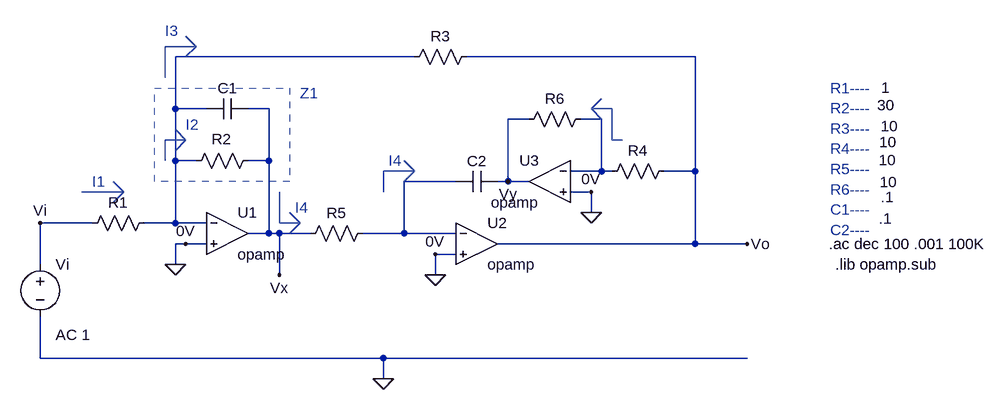
[diagram p0: schematic Simulacion TS2.asc]
Simulacion TS2.asc, the LTspice schematic file:
Version 4
SHEET 1 1208 680
WIRE 304 16 -64 16
WIRE 736 16 384 16
WIRE -64 96 -64 16
WIRE -16 96 -64 96
WIRE 80 96 48 96
WIRE 480 112 448 112
WIRE 592 112 560 112
WIRE -64 176 -64 96
WIRE -32 176 -64 176
WIRE 80 176 80 96
WIRE 80 176 48 176
WIRE 592 192 592 112
WIRE 592 192 544 192
WIRE 608 192 592 192
WIRE 736 192 736 16
WIRE 736 192 688 192
WIRE 368 208 288 208
WIRE 448 208 448 112
WIRE 448 208 432 208
WIRE 480 208 448 208
WIRE 576 224 544 224
WIRE 576 256 576 224
WIRE -192 272 -272 272
WIRE -64 272 -64 176
WIRE -64 272 -112 272
WIRE -16 272 -64 272
WIRE 80 288 80 176
WIRE 80 288 48 288
WIRE 96 288 80 288
WIRE 144 288 96 288
WIRE 288 288 288 208
WIRE 288 288 224 288
WIRE 368 288 288 288
WIRE -48 304 -64 304
WIRE -16 304 -48 304
WIRE 736 304 736 192
WIRE 736 304 432 304
WIRE 816 304 736 304
WIRE 368 320 336 320
WIRE -272 336 -272 272
WIRE -64 336 -64 304
WIRE 96 352 96 288
WIRE 336 352 336 320
WIRE -272 480 -272 416
WIRE 256 480 -272 480
WIRE 816 480 256 480
WIRE 256 512 256 480
FLAG 576 256 0
FLAG 336 352 0
FLAG -64 336 0
FLAG 256 512 0
FLAG 816 304 Vo
FLAG -272 272 Vi
FLAG 336 320 0V
FLAG -48 304 0V
FLAG 576 224 0V
FLAG 96 352 Vx
FLAG 448 208 Vy
SYMBOL res -96 256 R90
WINDOW 0 0 56 VBottom 2
WINDOW 3 -208 -1125 VTop 2
SYMATTR InstName R1
SYMATTR Value 1
SYMBOL res 64 160 R90
WINDOW 0 -2 57 VBottom 2
WINDOW 3 -85 -966 VTop 2
SYMATTR InstName R2
SYMATTR Value 30
SYMBOL res 400 0 R90
WINDOW 0 0 56 VBottom 2
WINDOW 3 107 -635 VTop 2
SYMATTR InstName R3
SYMATTR Value 10
SYMBOL res 576 96 R90
WINDOW 0 0 56 VBottom 2
WINDOW 3 97 -458 VTop 2
SYMATTR InstName R6
SYMATTR Value 10
SYMBOL res 240 272 R90
WINDOW 0 0 56 VBottom 2
WINDOW 3 -113 -792 VTop 2
SYMATTR InstName R5
SYMATTR Value 10
SYMBOL res 704 176 R90
WINDOW 0 0 56 VBottom 2
WINDOW 3 -44 -329 VTop 2
SYMATTR InstName R4
SYMATTR Value 10
SYMBOL cap 48 80 R90
WINDOW 0 0 32 VBottom 2
WINDOW 3 136 -984 VTop 2
SYMATTR InstName C1
SYMATTR Value .1
SYMBOL cap 432 192 R90
WINDOW 0 0 32 VBottom 2
WINDOW 3 57 -597 VTop 2
SYMATTR InstName C2
SYMATTR Value .1
SYMBOL OpAmps\\opamp 16 224 R0
SYMATTR InstName U1
SYMBOL OpAmps\\opamp 400 240 R0
SYMATTR InstName U2
SYMBOL OpAmps\\opamp 512 144 M0
SYMATTR InstName U3
SYMBOL voltage -272 320 R0
WINDOW 123 24 124 Left 2
WINDOW 39 0 0 Left 0
SYMATTR InstName Vi
SYMATTR Value ""
SYMATTR Value2 AC 1
TEXT 942 304 Left 2 !.ac dec 100 .001 100K
TEXT 944 64 Left 2 ;R1----\nR2----\nR3----\nR4----\nR5----\nR6----\nC1----\nC2----
TEXT 952 336 Left 2 !.lib opamp.sub
TEXT -192 208 Left 2 ;I1
TEXT -48 120 Left 2 ;I2
TEXT -80 -24 Left 2 ;I3
TEXT 120 248 Left 2 ;I4
TEXT 264 176 Left 2 ;I4
TEXT 128 72 Left 2 ;Z1
LINE Normal -144 224 -208 224
LINE Normal -160 208 -144 224
LINE Normal -160 240 -144 224
LINE Normal -80 0 -80 32
LINE Normal -32 0 -80 0
LINE Normal -48 -16 -32 0
LINE Normal -48 16 -32 0
LINE Normal -80 48 -80 32
LINE Normal -48 144 -80 144
LINE Normal -64 128 -48 144
LINE Normal -64 160 -48 144
LINE Normal -80 176 -80 144
LINE Normal 96 272 96 224
LINE Normal 128 272 96 272
LINE Normal 112 256 128 272
LINE Normal 112 288 128 272
LINE Normal 256 192 256 224
LINE Normal 304 192 256 192
LINE Normal 288 176 304 192
LINE Normal 288 208 304 192
LINE Normal 608 144 624 144
LINE Normal 608 96 608 144
LINE Normal 576 96 608 96
LINE Normal 592 80 576 96
LINE Normal 592 112 576 96
RECTANGLE Normal 112 208 -96 64 4

The netlist it stands for:
* Simulacion TS2.asc
R1 N001 Vi 1
R2 Vx N001 30
R3 Vo N001 10
R6 N002 Vy 10
R5 N003 Vx 10
R4 Vo N002 10
C1 Vx N001 .1
C2 Vy N003 .1
XU1 N001 0 Vx opamp Aol=100K GBW=10Meg  ; pins invin noninvin out
XU2 N003 0 Vo opamp Aol=100K GBW=10Meg  ; pins invin noninvin out
XU3 N002 0 Vy opamp Aol=100K GBW=10Meg  ; pins invin noninvin out
Vi Vi 0 AC 1
.ac dec 100 .001 100K
* R1----
* R2----
* R3----
* R4----
* R5----
* R6----
* C1----
* C2----
.lib opamp.sub
* I1
* I2
* I3
* I4
* I4
* Z1
.backanno
.end